# Altium schematic sheet SensWear_TitlePage.SchDoc
size A4; Size: A4; SheetNumber: 8; SheetTotal: 9
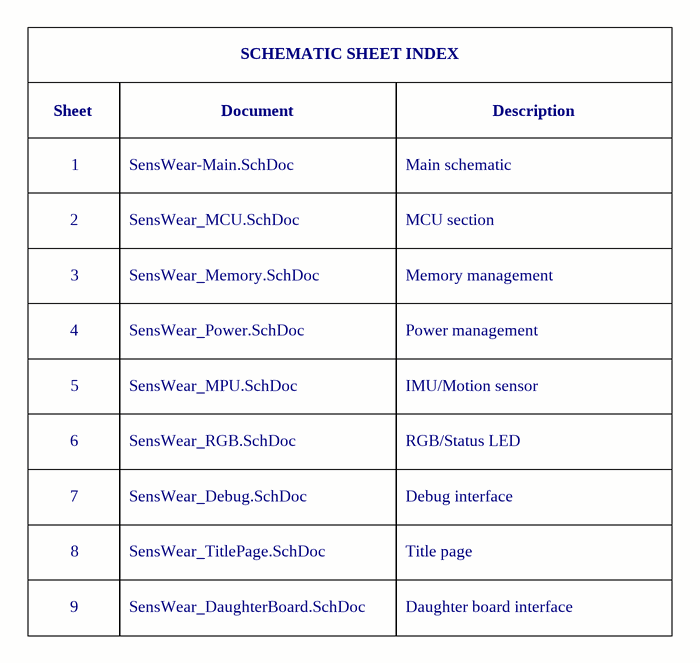
[diagram p0: SensWear_TitlePage.SchDoc]

## Notes on the sheet
- SCHEMATIC SHEET INDEX
- Sheet
- Document
- Description
- 2
- 1
- SensWear-Main.SchDoc
- SensWear_MCU.SchDoc
- Main schematic
- MCU section
- 4
- 3
- SensWear_Memory.SchDoc
- SensWear_Power.SchDoc
- Memory management
- Power management
- 5
- SensWear_MPU.SchDoc
- IMU/Motion sensor
- 6
- 7
- SensWear_RGB.SchDoc
- SensWear_Debug.SchDoc
- RGB/Status LED
- Debug interface
- 9
- 8
- SensWear_TitlePage.SchDoc
- SensWear_DaughterBoard.SchDoc
- Title page
- Daughter board interface
- Designer/Engineer
- Drawn By
- Document Name
- Board Title
- of
- Size
- A4
- Approved By
- Rev.
- Date